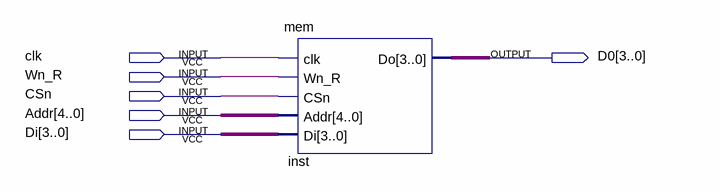
[diagram p0: schematic sheet]
// Quartus schematic lab15_2.bdf as structural Verilog: 1 symbols, 6 pins
module lab15_2 (
  input  clk,
  input  Wn_R,
  input  CSn,
  input  [4:0] Addr,
  input  [3:0] Di,
  output [3:0] D0
);

  mem inst (.clk(clk), .Wn_R(Wn_R), .CSn(CSn), .Addr(Addr), .Di(Di), .Do(D0));
endmodule
